# Altium schematic sheet RS485_RGB_Connector.SchDoc
size A4; Organization: Altium Limited; Address1: L3, 12a Rodborough Rd; Address2: Frenchs Forest; Address3: NSW; Address4: Australia 2086
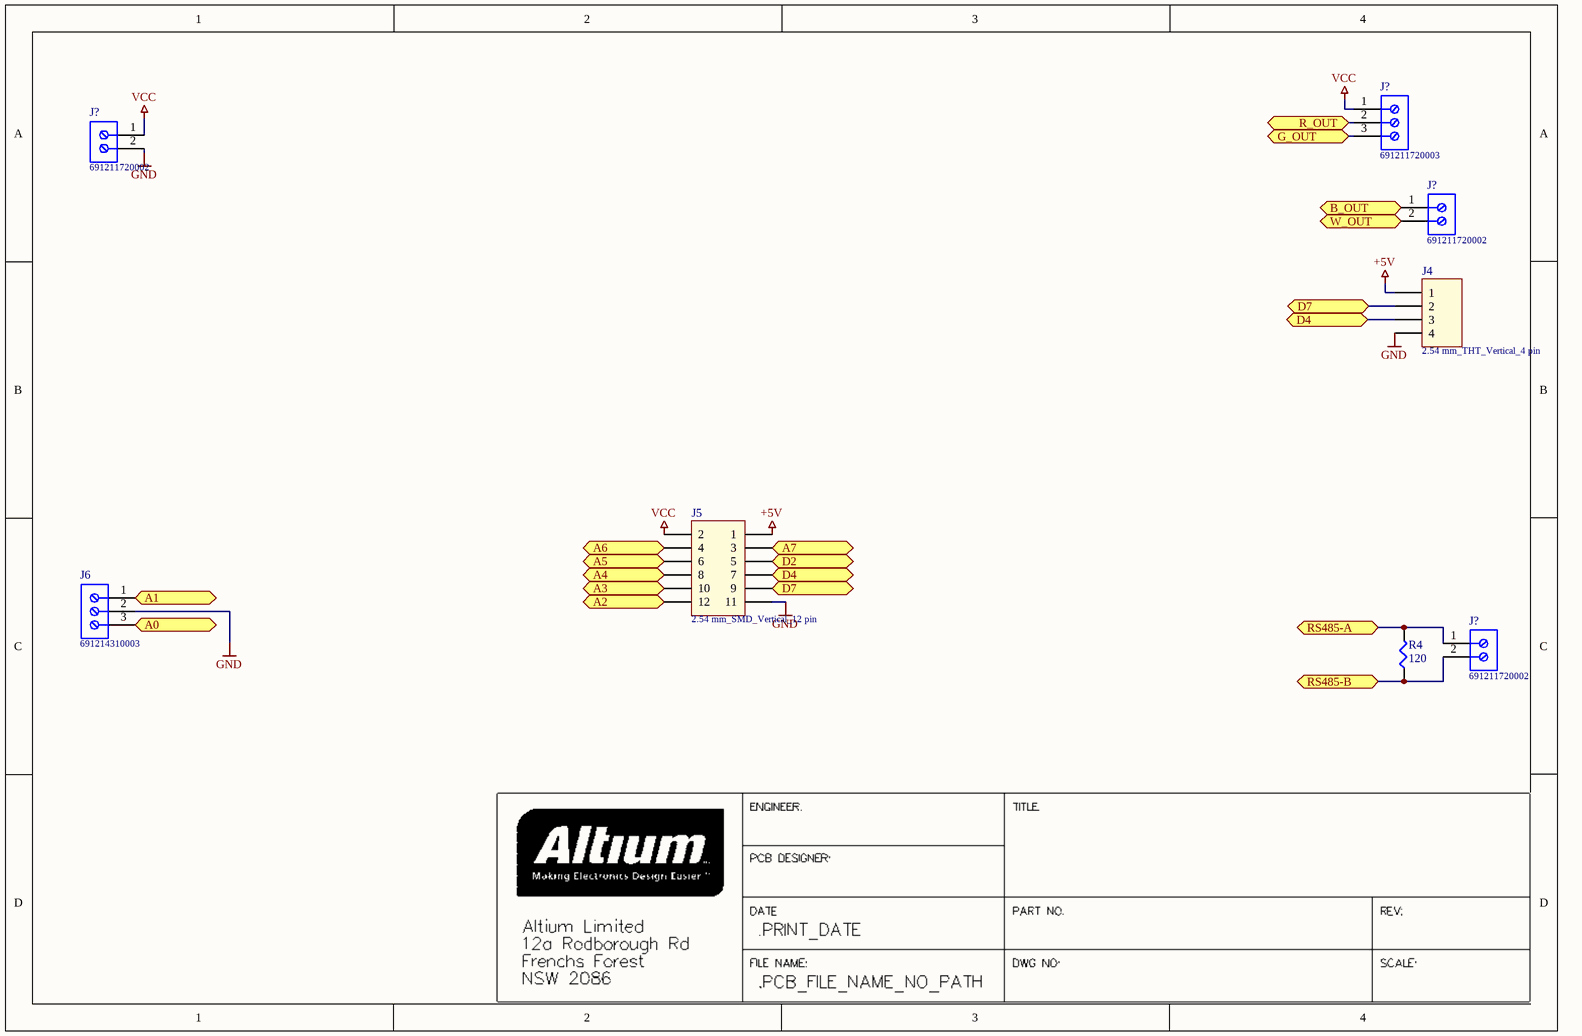
[diagram p0: RS485_RGB_Connector.SchDoc]

## Parts
(Parts that share a designator on the sheet are numbered #1, #2 ... from top to bottom, then left to right.)
J4  2.54 mm_THT_Vertical_4 pin  [61300411121]
J5  2.54 mm_SMD_Vertical_12 pin  [61001221121]
J6  691214310003  [691214310003]
J?#1  691211720003  [691211720003]
J?#2  691211720002  [691211720002]
J?#3  691211720002  [691211720002]
J?#4  691211720002  [691211720002]
R4  120  [SMD-0603-RES]

## Ports
A0, A1, A2, A3, A4, A5, A6, A7, B_OUT, D2, D4, D7, G_OUT, R_OUT, RS485-A, RS485-B, W_OUT

## Nets
+5V: J4.1 J5.1
GND: J4.4 J5.11 J6.2 J?#2.2
VCC: J5.2 J?#1.1 J?#2.1
A0: J6.3 ; port A0
A1: J6.1 ; port A1
A2: J5.12 ; port A2
A3: J5.10 ; port A3
A4: J5.8 ; port A4
A5: J5.6 ; port A5
A6: J5.4 ; port A6
A7: J5.3 ; port A7
B_OUT: J?#3.1 ; port B_OUT
D2: J5.5 ; port D2
D4: J4.3 J5.7 ; port D4
D7: J4.2 J5.9 ; port D7
G_OUT: J?#1.3 ; port G_OUT
R_OUT: J?#1.2 ; port R_OUT
RS485-A: J?#4.1 R4.2 ; port RS485-A
RS485-B: J?#4.2 R4.1 ; port RS485-B
W_OUT: J?#3.2 ; port W_OUT

## Library data of the parts
J4 = 61300411121: Pin Header WR-PHD, pitch 2.54 mm, THT, Vertical, single row, 4 pin; Rated Current: 3 A; Pin Number: 4; Pitch: 2.54 mm; Working Voltage: 250 VAC; Contact Resistance: 20 mOhm; Insulation Resistance: >1000 MOhm; ComponentLink1Description: Manufacturer; ComponentLink1URL: http://www.we-online.de; ComponentLink2Description: Datasheet; ComponentLink2URL: http://katalog.we-online.de/em/datasheet/6130xx11121.pdf; Part Number: 61300411121; Published Date: Jan. 2018; Publisher: Wurth Elektronik; Operating Temperature: -40 to 105 degC; Mounting Technology: THT; Row Number: Single; Orientation: Vertical
J5 = 61001221121: Pin Header WR-PHD, pitch 2.54 mm, SMD, Vertical, dual row, 12 pin; Rated Current: 3 A; Pin Number: 12; Pitch: 2.54 mm; Working Voltage: 250 VAC; Contact Resistance: 20 mOhm; Insulation Resistance: >1000 MOhm; ComponentLink1Description: Manufacturer; ComponentLink1URL: http://www.we-online.de; ComponentLink2Description: Datasheet; ComponentLink2URL: http://katalog.we-online.de/em/datasheet/6100xx21121.pdf; Part Number: 61001221121; Published Date: Jan. 2018; Publisher: Wurth Elektronik; Operating Temperature: -40 to 105 degC; Mounting Technology: SMD; Row Number: Dual; Orientation: Vertical
J6 = 691214310003: Serie 2143 - 3.81 mm Horizontal Cable Entry with Rising Cage Clamp WR-TBL, 3 pin; Pin Number: 3; Pitch: 3.81 mm; ComponentLink1Description: Manufacturer; ComponentLink1URL: http://www.we-online.de; ComponentLink2Description: Datasheet; ComponentLink2URL: http://katalog.we-online.de/em/datasheet/6912143100xx.pdf; Part Number: 691214310003; Published Date: June 2018; Publisher: Wurth Elektronik; Operating Temperature: -40 to 105 degC; Mounting Technology: THT; Packaging: Box
J?#1 = 691211720003: Serie 211 - 5.00 mm 45deg Entry Modular with Rising Cage Clamp - 15.50 mm Height WR-TBL, 3 pin; Pin Number: 3; Pitch: 5.00 mm; ComponentLink1Description: Manufacturer; ComponentLink1URL: http://www.we-online.de; ComponentLink2Description: Datasheet; ComponentLink2URL: http://katalog.we-online.de/em/datasheet/6912117200xx.pdf; Part Number: 691211720003; Published Date: June 2018; Publisher: Wurth Elektronik; Operating Temperature: -40 to 105 degC; Mounting Technology: THT; Packaging: Box
J?#2-J?#4 = 691211720002: Serie 211 - 5.00 mm 45deg Entry Modular with Rising Cage Clamp - 15.50 mm Height WR-TBL, 2 pin; Pin Number: 2; Pitch: 5.00 mm; ComponentLink1Description: Manufacturer; ComponentLink1URL: http://www.we-online.de; ComponentLink2Description: Datasheet; ComponentLink2URL: http://katalog.we-online.de/em/datasheet/6912117200xx.pdf; Part Number: 691211720002; Published Date: June 2018; Publisher: Wurth Elektronik; Operating Temperature: -40 to 105 degC; Mounting Technology: THT; Packaging: Box
R4 = ERJ-3EKF1200V: RES SMD 120 OHM 1% 1/10W 0603; Manufacturer: Panasonic Electronic Components; Factory Stock: 0; Unit Price (USD): 0.00379; @ qty: 1500; Minimum Quantity: 1; Power (Watts): 0.1W, 1/10W; Temperature Coefficient: ±100ppm/°C; Part Number: ERJ-3EKF1200V; Datasheets: http://industrial.panasonic.com/www-cgi/jvcr13pz.cgi?E+PZ+3+AOA0002+ERJ3EKF1200V+7+WW; Image: //media.digikey.com/Photos/Panasonic%20Photos/MFG_ERJ-P6W%20Series.jpg; Digi-Key Part Number: P120HCT-ND; Quantity Available: 84623; Packaging: Cut Tape (CT); Series: ERJ; Part Status: Active; Value: 120; Tolerance: ±1%; Composition: Thick Film; Features: Automotive AEC-Q200; Operating Temperature: -55°C ~ 155°C; Package / Case: 0603 (1608 Metric); Supplier Device Package: 0603; Size / Dimension: 0.063" L x 0.031" W (1.60mm x 0.80mm); Height - Seated (Max): 0.022" (0.55mm); Number of Terminations: 2; Failure Rate: -